# Altium project R1051-Caceres-PF.PrjPcb (part 1 of 3)
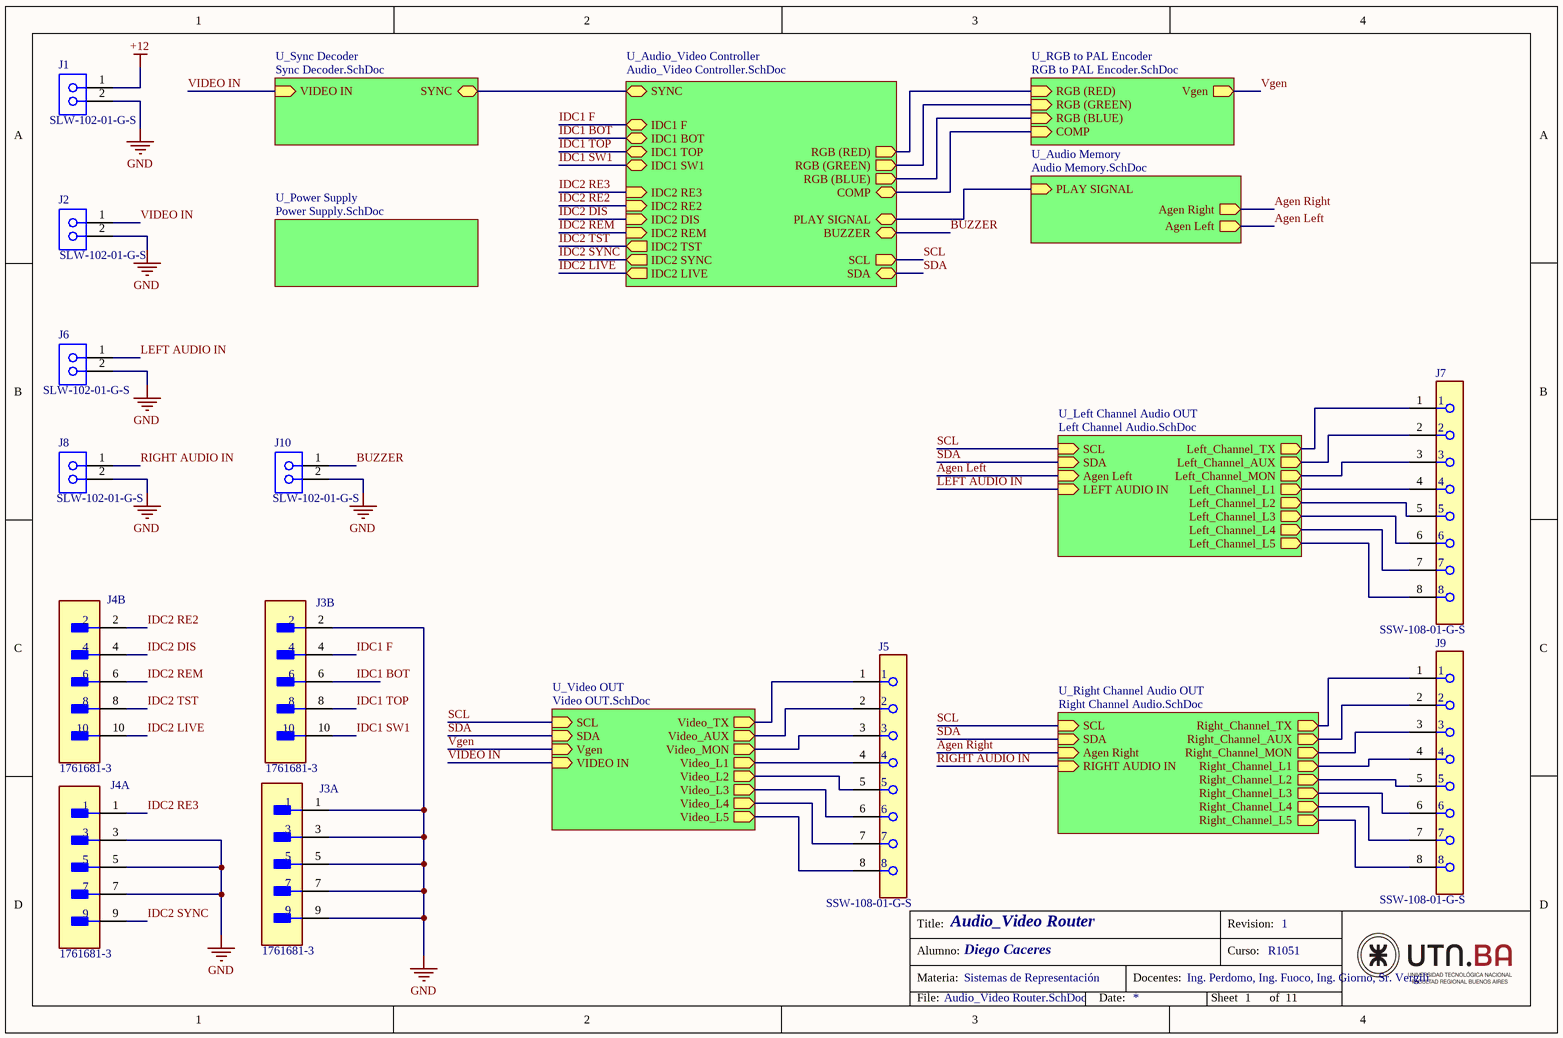
[diagram p0: Audio_Video Router.SchDoc]
11 sheets, 204 parts. Net scope: hierarchical (ports join the sheet entries above them; power ports are global).
Board file: Audio_Video Router.PcbDoc
Sheets:
  Audio_Video Router.SchDoc
    U_Sync Decoder = Sync Decoder.SchDoc
    U_Power Supply = Power Supply.SchDoc
    U_Audio_Video Controller = Audio_Video Controller.SchDoc
      U_RGB Video Controller = RGB Video Controller.SchDoc
      U_Audio Controller = Audio Controller.SchDoc
    U_Audio Memory = Audio Memory.SchDoc
    U_RGB to PAL Encoder = RGB to PAL Encoder.SchDoc
    U_Video OUT = Video OUT.SchDoc
    U_Left Channel Audio OUT = Left Channel Audio.SchDoc
    U_Right Channel Audio OUT = Right Channel Audio.SchDoc

## Sheet Audio_Video Router.SchDoc: Audio_Video Router
size A4; Organization: Altium Limited; Address1: L3, 12a Rodborough Rd; Address2: Frenchs Forest; Address3: NSW; Address4: Australia 2086; Revision: 1; SheetNumber: 1; SheetTotal: 11; Alumno: Diego Caceres; Curso: R1051; Materia: Sistemas de Representación; Docentes: Ing. Perdomo, Ing. Fuoco, Ing. Giorno, Sr. Vergili

### Parts
J1  SLW-102-01-G-S  [SMTC-SLW-102-01-X-S]
J2  SLW-102-01-G-S  [SMTC-SLW-102-01-X-S]
J3  1761681-3  [FP-1761681-3-MFG]  (parts A,B of 2)
J4  1761681-3  [FP-1761681-3-MFG]  (parts A,B of 2)
J5  SSW-108-01-G-S  [FP-SSW-108-01-G-S-MFG]
J6  SLW-102-01-G-S  [SMTC-SLW-102-01-X-S]
J7  SSW-108-01-G-S  [FP-SSW-108-01-G-S-MFG]
J8  SLW-102-01-G-S  [SMTC-SLW-102-01-X-S]
J9  SSW-108-01-G-S  [FP-SSW-108-01-G-S-MFG]
J10  SLW-102-01-G-S  [SMTC-SLW-102-01-X-S]

### Sub-sheets
U_Audio Memory = Audio Memory.SchDoc: PLAY SIGNAL (in), Agen Right (out), Agen Left (out)
U_Audio_Video Controller = Audio_Video Controller.SchDoc: RGB (RED) (out), RGB (GREEN) (out), RGB (BLUE) (out), COMP (bidir), SYNC (bidir), IDC2 SYNC (out), IDC2 LIVE (out), IDC2 TST (out), IDC2 REM (in), IDC2 DIS (in), IDC2 RE2 (in), IDC2 RE3 (in), IDC1 F (bidir), IDC1 BOT (bidir), IDC1 TOP (bidir), IDC1 SW1 (bidir), SCL (out), SDA (bidir), PLAY SIGNAL (bidir), BUZZER (bidir)
U_Left Channel Audio OUT = Left Channel Audio.SchDoc: Left_Channel_TX (out), Left_Channel_AUX (out), Left_Channel_MON (out), Left_Channel_L1 (out), SCL (in), SDA (in), Left_Channel_L2 (out), Left_Channel_L3 (out), Left_Channel_L4 (out), Left_Channel_L5 (out), Agen Left (in), LEFT AUDIO IN (in)
U_Power Supply = Power Supply.SchDoc: no entries
U_RGB to PAL Encoder = RGB to PAL Encoder.SchDoc: COMP (in), RGB (RED) (in), RGB (GREEN) (in), RGB (BLUE) (in), Vgen (out)
U_Right Channel Audio OUT = Right Channel Audio.SchDoc: Right_Channel_TX (out), Right_Channel_AUX (out), Right_Channel_MON (out), Right_Channel_L1 (out), SCL (in), SDA (in), Right_Channel_L2 (out), Right_Channel_L3 (out), Right_Channel_L4 (out), Right_Channel_L5 (out), Agen Right (in), RIGHT AUDIO IN (in)
U_Sync Decoder = Sync Decoder.SchDoc: VIDEO IN (in), SYNC (bidir)
U_Video OUT = Video OUT.SchDoc: Video_TX (out), Video_AUX (out), Video_MON (out), Video_L1 (out), SCL (in), SDA (in), Video_L2 (out), Video_L3 (out), Video_L4 (out), Video_L5 (out), Vgen (in), VIDEO IN (in)

### Nets
+12: J1.1
GND: J1.2 J2.2 J3.1 J3.2 J3.3 J3.5 J3.7 J3.9 J4.3 J4.5 J4.7 J6.2 J8.2 J10.2
Agen Left: sheet U_Audio Memory/Agen Left, sheet U_Left Channel Audio OUT/Agen Left
Agen Right: sheet U_Audio Memory/Agen Right, sheet U_Right Channel Audio OUT/Agen Right
BUZZER: J10.1 ; sheet U_Audio_Video Controller/BUZZER
COMP: sheet U_Audio_Video Controller/COMP, sheet U_RGB to PAL Encoder/COMP
IDC1 BOT: J3.6 ; sheet U_Audio_Video Controller/IDC1 BOT
IDC1 F: J3.4 ; sheet U_Audio_Video Controller/IDC1 F
IDC1 SW1: J3.10 ; sheet U_Audio_Video Controller/IDC1 SW1
IDC1 TOP: J3.8 ; sheet U_Audio_Video Controller/IDC1 TOP
IDC2 DIS: J4.4 ; sheet U_Audio_Video Controller/IDC2 DIS
IDC2 LIVE: J4.10 ; sheet U_Audio_Video Controller/IDC2 LIVE
IDC2 RE2: J4.2 ; sheet U_Audio_Video Controller/IDC2 RE2
IDC2 RE3: J4.1 ; sheet U_Audio_Video Controller/IDC2 RE3
IDC2 REM: J4.6 ; sheet U_Audio_Video Controller/IDC2 REM
IDC2 SYNC: J4.9 ; sheet U_Audio_Video Controller/IDC2 SYNC
IDC2 TST: J4.8 ; sheet U_Audio_Video Controller/IDC2 TST
LEFT AUDIO IN: J6.1 ; sheet U_Left Channel Audio OUT/LEFT AUDIO IN
PLAY SIGNAL: sheet U_Audio_Video Controller/PLAY SIGNAL, sheet U_Audio Memory/PLAY SIGNAL
RIGHT AUDIO IN: J8.1 ; sheet U_Right Channel Audio OUT/RIGHT AUDIO IN
SCL: sheet U_Audio_Video Controller/SCL, sheet U_Video OUT/SCL, sheet U_Left Channel Audio OUT/SCL, sheet U_Right Channel Audio OUT/SCL
SDA: sheet U_Audio_Video Controller/SDA, sheet U_Video OUT/SDA, sheet U_Left Channel Audio OUT/SDA, sheet U_Right Channel Audio OUT/SDA
Vgen: sheet U_RGB to PAL Encoder/Vgen, sheet U_Video OUT/Vgen
VIDEO IN: J2.1 ; sheet U_Sync Decoder/VIDEO IN, sheet U_Video OUT/VIDEO IN
NetC8_1: sheet U_Sync Decoder/SYNC, sheet U_Audio_Video Controller/SYNC
NetC22_1: sheet U_Audio_Video Controller/RGB (RED), sheet U_RGB to PAL Encoder/RGB (RED)
NetC24_1: sheet U_Audio_Video Controller/RGB (GREEN), sheet U_RGB to PAL Encoder/RGB (GREEN)
NetC25_1: sheet U_Audio_Video Controller/RGB (BLUE), sheet U_RGB to PAL Encoder/RGB (BLUE)
NetC42_1: J7.1 ; sheet U_Left Channel Audio OUT/Left_Channel_TX
NetC44_1: J7.2 ; sheet U_Left Channel Audio OUT/Left_Channel_AUX
NetC45_1: J7.3 ; sheet U_Left Channel Audio OUT/Left_Channel_MON
NetC47_1: J7.4 ; sheet U_Left Channel Audio OUT/Left_Channel_L1
NetC48_1: J7.5 ; sheet U_Left Channel Audio OUT/Left_Channel_L2
NetC50_1: J7.6 ; sheet U_Left Channel Audio OUT/Left_Channel_L3
NetC55_1: J7.7 ; sheet U_Left Channel Audio OUT/Left_Channel_L4
NetC56_1: J7.8 ; sheet U_Left Channel Audio OUT/Left_Channel_L5
NetC59_1: J9.1 ; sheet U_Right Channel Audio OUT/Right_Channel_TX
NetC61_1: J9.2 ; sheet U_Right Channel Audio OUT/Right_Channel_AUX
NetC63_1: J9.3 ; sheet U_Right Channel Audio OUT/Right_Channel_MON
NetC64_1: J9.4 ; sheet U_Right Channel Audio OUT/Right_Channel_L1
NetC66_1: J9.5 ; sheet U_Right Channel Audio OUT/Right_Channel_L2
NetC68_1: J9.6 ; sheet U_Right Channel Audio OUT/Right_Channel_L3
NetC70_1: J9.7 ; sheet U_Right Channel Audio OUT/Right_Channel_L4
NetC72_1: J9.8 ; sheet U_Right Channel Audio OUT/Right_Channel_L5
NetJ5_1: J5.1 ; sheet U_Video OUT/Video_TX
NetJ5_2: J5.2 ; sheet U_Video OUT/Video_AUX
NetJ5_3: J5.3 ; sheet U_Video OUT/Video_MON
NetJ5_4: J5.4 ; sheet U_Video OUT/Video_L1
NetJ5_5: J5.5 ; sheet U_Video OUT/Video_L2
NetJ5_6: J5.6 ; sheet U_Video OUT/Video_L3
NetJ5_7: J5.7 ; sheet U_Video OUT/Video_L4
NetJ5_8: J5.8 ; sheet U_Video OUT/Video_L5

### Notes on the sheet
- Title:
- Revision:
- Alumno:
- Materia:
- Docentes:
- Curso:
- File:
- Date:
- Sheet
- of

### Library data of the parts
J1 J2 J6 J8 J10 = CMP-1023-00125-1: Low Profile Socket Strips, Through-hole, Vertical, -55 to 125 degC, 2.54 mm Pitch, 2-Pin, Female, RoHS; Manufacturer: Samtec; Pitch: 2.54 mm; PartNumber: SLW-102-01-G-S; ComponentLink3Description: Package Specification; Mounting Technology: Through-hole; DatasheetVersion: F-214; PackageVersion: X, 9/1987; ComponentLink3URL: http://www.samtec.com/documents/webfiles/cpdf/SLW-1XX-01-X-X-MKT.pdf; Orientation: Vertical; RoHS: True; PackageReference: SLW-102-01-X-S; ComponentLink2URL: http://www.samtec.com/documents/webfiles/pdf/SLW.PDF; Temperature Range: -55 to 125 degC; ComponentLink1URL: http://www.samtec.com; ComponentLink1Description: Manufacturer URL; ComponentLink2Description: Datasheet; PackageDescription: Low Profile Socket Strip
J3 J4 = CMP-03790-46506244-1: 1761681-3 Conn Shrouded Header (4 Sides) HDR 10 POS 2.54mm Solder ST Top Entry Thru-Hole Tray; Manufacturer Lifecycle Status: ACTIVE; Number of Contacts: 10; Current Rating: 1A; Connector Type: Header, Pin, Plug; Circuit Application: Signal; Voltage Rating: 250V; Insulation Resistance: 5GΩ; Lead Length: 2.9mm; PCB Mount Retention: Without; PCB Mounting Orientation: Vertical; Connector System: Wire-to-Board; Number of Rows: 2; Row Spacing: 2.54mm; Lead Pitch: 2.54mm; Contact Mating Length: 6.096mm; Depth: 9.22mm; Shrouded End Dimension: 3.81mm; Length: 20.32mm; Mount: Through Hole; Termination: Solder, Through Hole; Orientation: Vertical; Pitch: 2.54mm; Contact Gender: Male; Contact Material: Bronze; Contact Shape: Square; Height: 8.89mm; Housing Material: Polycyclohexylenedimethylene; Contact Current Rating: 1A; Operating Supply Voltage: 250V; Lifecycle Status: Production; Color: Black; NexarPartId: 46506244; Contact Plating: Gold, Tin; Packaging: Bulk; Flammability Rating: UL94 V-0; Max Operating Temperature: 105°C; Max Voltage Rating (AC): 250V; RoHS: Compliant; Mating Connector Lock: Without; Number of Positions: 10; Housing Color: Black; REACH SVHC: No SVHC; Radiation Hardening: No; Min Operating Temperature: -65°C
J5 J7 J9 = CMP-1272-00001-2: CONN RCPT 8POS 0.1 GOLD PCB; Pitch: 2.54mm; Number of Positions: 8; Max Current Rating: 6.9A; Gender: Receptacle; Max Voltage Rating (AC): 550V; Contact Resistance: 10mR; Mating Cycles: 100; Connector Type: Socket; Series: SSW; Length: 20.83mm; Packaging: Bulk; Contact Material: Bronze; Color: Black; Housing Material: Polymer; Number of Rows: 1; REACH SVHC: No SVHC; Lead Free: Lead Free; Termination: Solder; Max Operating Temperature: 125°C; Depth: 2.41mm; Number of Contacts: 8; Min Operating Temperature: -55°C; Housing Color: Black; RoHS Compliant: Yes; Contact Plating: Gold; Radiation Hardening: No; Contact Type: Female Socket; Orientation: Vertical; Voltage Rating: 550V; Current Rating: 6.9A

## Sheet Sync Decoder.SchDoc: Sync Decoder
size A4; Organization: Altium Limited; Address1: L3, 12a Rodborough Rd; Address2: Frenchs Forest; Address3: NSW; Address4: Australia 2086; Revision: 1; SheetNumber: 3; SheetTotal: 11; Alumno: Diego Caceres; Curso: R1051; Materia: Sistemas de Representación; Docentes: Ing. Perdomo, Ing. Fuoco, Ing. Giorno, Sr. Vergili
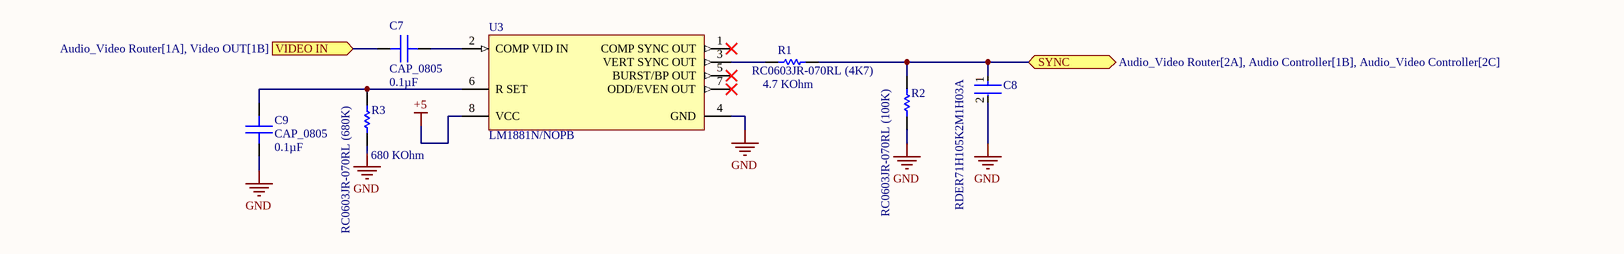
[diagram p1: Sync Decoder.SchDoc]

### Parts
C7  CAP_0805  value 0.1µF  [0805_CAPACITOR_DCACERES]
C8  RDER71H105K2M1H03A  [FP-RDE2M1-MFG]
C9  CAP_0805  value 0.1µF  [0805_CAPACITOR_DCACERES]
R1  RC0603JR-070RL (4K7)  Resistance: 4.7 KOhm  [RESC1608X55X25ML10T15]
R2  RC0603JR-070RL (100K)  [RESC1608X55X25ML10T15]
R3  RC0603JR-070RL (680K)  Resistance: 680 KOhm  [RESC1608X55X25ML10T15]
U3  LM1881N/NOPB  [P0008A]

### Ports
SYNC (bidir, see Audio_Video Router[2A], Audio Controller[1B], Audio_Video Controller[2C]), VIDEO IN (in, see Audio_Video Router[1A], Video OUT[1B])

### Nets
+5: U3.8(VCC)  [project net VDD]
GND: C8.2 C9.1 R2.1 R3.1 U3.4(GND)
VIDEO IN: C7.1 ; port VIDEO IN
NetC7_2: C7.2 U3.2(COMP_VID_IN)
NetC8_1: C8.1 R1.1 R2.2 ; port SYNC
NetC9_2: C9.2 R3.2 U3.6(R_SET)
NetR1_2: R1.2 U3.3(VERT_SYNC_OUT)

Not connected (* = marked no-connect by the designer): U3 1(COMP_SYNC_OUT)* 5(BURST/BP_OUT)* 7(ODD/EVEN_OUT)*

### Notes on the sheet
- Title:
- Revision:
- Alumno:
- Materia:
- Docentes:
- Curso:
- File:
- Date:
- Sheet
- of

### Library data of the parts
C7 C9 = CAPACITOR_0805_Caceres: Capacitor SMD, encapsulado 0805; SizePackage: 0805; ComponentLink1Description: Datasheet1; ComponentLink1URL: https://www.mouser.com/datasheet/2/40/AutoMLCCKAM-3216307.pdf; ComponentLink2Description: Datasheet2; ComponentLink2URL: https://www.mouser.com/datasheet/2/447/KEM_C1086_U2J-3316409.pdf; ComponentLink3Description: Datasheet3; ComponentLink3URL: https://product.tdk.com/system/files/dam/doc/product/capacitor/ceramic/mlcc/catalog/mlcc_commercial_soft_en.pdf
C8 = CMP-06035-045612-1: Ceramic Capacitor 1uF ±10% 50V X7R Radial; Lead Diameter: 0.5mm; Lead/Base Style: Kinked; Height - Seated (Max): 0.236inch; Tolerance: 10%; Height: 4mm; Package Quantity: 2000; Termination: Radial; Voltage Rating: 50V; Width: 4mm; Voltage Rating (DC): 50V; Lead Free: Lead Free; Case/Package: Radial; Length: 0.217inch; Mount: Through Hole; Dielectric: X7R; Packaging: Tape and Reel; Min Operating Temperature: -55°C; Max Operating Temperature: 125°C; Lead Pitch: 0.197inch; Capacitance: 1uF; Resistor Type: Ceramic
R1 R3 = CMP-2100-03667-1: Chip Resistor, 0 Ohm, +/- 5%, 0.1 W, -55 to 155 degC, 0603 (1608 Metric), RoHS, Tape and Reel; Manufacturer: Yageo; Temperature Coefficient: 200ppm/degreesC; Voltage Rating: 50V; Power Rating: 100mW; Width: 0.8mm; Max Operating Temperature: 155degC; Tolerance: 5%; Package Reference: 0603; Height: 0.45mm; Depth: 0.8mm; Package Description: 2-Pin Surface Mount Device, Body 1.6 x 0.8 mm; Termination: SMD/SMT; Package Quantity: 5000; Case/Package: 0603; Case Code (Imperial): 0603; Radiation Hardening: No; Number of Pins: 2; Length: 1.6mm; Lead Free: LeadFree; Voltage Rating (DC): 50V; Military Standard: Not; Datasheet URL: http://www.yageo.com/NewPortal/yageodocoutput?fileName=/pdf/R-Chip/PYu-RC_Group_51_RoHS_L_5.pdf; Manufacturer URL: http://www.yageo.com/; Packaging: TapeandReel; Case Code (Metric): 1608; Min Operating Temperature: -55degC; Composition: ThickFilm; RoHSCompliant: true; Contact Plating: Tin; Datasheet Version: Rev. 5, 10/2016; REACH SVHC: NoSVHC
R2 = CMP-2100-03667-1: Chip Resistor, 0 Ohm, +/- 5%, 0.1 W, -55 to 155 degC, 0603 (1608 Metric), RoHS, Tape and Reel; Manufacturer: Yageo; Temperature Coefficient: 200ppm/degreesC; Voltage Rating: 50V; Power Rating: 100mW; Resistance: 0mOhm; Width: 0.8mm; Max Operating Temperature: 155degC; Tolerance: 5%; Package Reference: 0603; Height: 0.45mm; Depth: 0.8mm; Package Description: 2-Pin Surface Mount Device, Body 1.6 x 0.8 mm; Termination: SMD/SMT; Package Quantity: 5000; Case/Package: 0603; Case Code (Imperial): 0603; Radiation Hardening: No; Number of Pins: 2; Length: 1.6mm; Lead Free: LeadFree; Voltage Rating (DC): 50V; Military Standard: Not; Datasheet URL: http://www.yageo.com/NewPortal/yageodocoutput?fileName=/pdf/R-Chip/PYu-RC_Group_51_RoHS_L_5.pdf; Manufacturer URL: http://www.yageo.com/; Packaging: TapeandReel; Case Code (Metric): 1608; Min Operating Temperature: -55degC; Composition: ThickFilm; RoHSCompliant: true; Contact Plating: Tin; Datasheet Version: Rev. 5, 10/2016; REACH SVHC: NoSVHC
U3 = CMP-0064-00008-3: Video Sync Separator, 8-pin MDIP, Pb-Free; Manufacturer: Texas Instruments; CompType: OtherParts; PowerWise: N; PackageTopMarking: NSUZXYTTE#*LM1881N; RoHS: Y; ComponentLink1Description: Datasheet URL; Code_JEDEC: MS-001-BA; PinCount: 8; PackageDescription: MDIP, .365 x .250 x .130in, 8 Lead, .100in Pitch; PackageReference: P0008A; ComponentLink1URL: http://www.ti.com/general/docs/lit/getliterature.tsp?genericPartNumber=LM1881&fileType=pdf

## Sheet Power Supply.SchDoc: Power Supply
size A4; Organization: Altium Limited; Address1: L3, 12a Rodborough Rd; Address2: Frenchs Forest; Address3: NSW; Address4: Australia 2086; Revision: 1; SheetNumber: 2; SheetTotal: 11; Alumno: Diego Caceres; Curso: R1051; Materia: Sistemas de Representación; Docentes: Ing. Perdomo, Ing. Fuoco, Ing. Giorno, Sr. Vergili
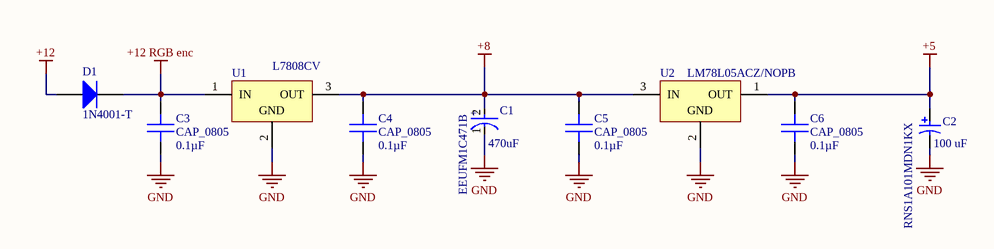
[diagram p2: Power Supply.SchDoc]

### Parts
C1  EEUFM1C471B  Capacitance: 470uF  [FP-RAD-TH-D_10_0_5-L_12_5-MFG]
C2  RNS1A101MDN1KX  Rated Capacitance: 100 uF  [NIC-RNS-8x11.5-2_V]
C3  CAP_0805  value 0.1µF  [0805_CAPACITOR_DCACERES]
C4  CAP_0805  value 0.1µF  [0805_CAPACITOR_DCACERES]
C5  CAP_0805  value 0.1µF  [0805_CAPACITOR_DCACERES]
C6  CAP_0805  value 0.1µF  [0805_CAPACITOR_DCACERES]
D1  1N4001-T  [DIOD-DO-41-P-2_V]
U1  L7808CV  [TO220]
U2  LM78L05ACZ/NOPB  [LP0003A]

### Nets
+5: C2.1 C6.1 U2.1(OUT)  [project net VDD]
+8: C1.2(A) C4.1 C5.1 U1.3(OUT) U2.3(IN)
+12: D1.1(A)
+12 RGB enc: C3.1 D1.2(K) U1.1(IN)
GND: C1.1(C) C2.2 C3.2 C4.2 C5.2 C6.2 U1.2(GND) U2.2(GND)

### Notes on the sheet
- Title:
- Revision:
- Alumno:
- Materia:
- Docentes:
- Curso:
- File:
- Date:
- Sheet
- of
- (in symbol CMP-05427-001980-1) +

### Library data of the parts
C1 = CMP-05427-001980-1: Aluminum Electrolytic Capacitors (Radial Lead Type) 470uF ±20% 16V; Ripple Current: 1.29A; ESR (Equivalent Series Resistance): 38mR; Life (Hours): 4000Hour; Lead Diameter: 0.6mm; Height: 12.5mm; Package Quantity: 500; Lead Free: Lead Free; Voltage Rating: 16V; Diameter: 10mm; Radiation Hardening: No; Packaging: Tape and Reel; Case/Package: Radial; Tolerance: 20%; Series: FM; Height - Seated (Max): 0.551inch; Max Operating Temperature: 105°C; Termination: Radial; Mount: Through Hole; RoHS Compliant: Yes; Voltage Rating (DC): 16V; Impedance: 38mR; Length: 12.5mm; Lead Pitch: 5mm; Min Operating Temperature: -40°C
C2 = CMP-1235-00001-1: Aluminum Electrolytic Capacitor, 100 uF +/-20%, 10 V, -55 to 105 degC, 2-Pin THD, RoHS; Manufacturer: Nichicon; Rated Ripple: 3900 mA; Rated Voltage: 10 V; Leakage Current: 0.15 mA; Capacitance Tolerance: +/-20%; ComponentLink1URL: http://www.nichicon.co.jp/; ComponentLink3URL: http://www.nichicon.co.jp/english/products/pdf/2013fpcap_catalog_ns.pdf; ComponentLink1Description: Manufacturer URL; ComponentLink2URL: http://www.nichicon.co.jp/english/products/pdfs/e-ns.pdf; PackageDescription: 2-Pin Through Hole Device, Dia 8 mm, Body Length 11.5 mm, Pin Spacing 3.5 mm; Temperature Range: -55 to 105 degC; ComponentLink3Description: Package Specification; PartNumber: RNS1A101MDN1KX; Mounting Technology: Through Hole; DatasheetVersion: Sep-13; RoHS: TRUE; ComponentLink2Description: Datasheet
C3-C6 = CAPACITOR_0805_Caceres: as C7 on sheet Sync Decoder; ComponentLink1Description: Datasheet1; ComponentLink1URL: https://www.mouser.com/datasheet/2/40/AutoMLCCKAM-3216307.pdf; ComponentLink2Description: Datasheet2; ComponentLink2URL: https://www.mouser.com/datasheet/2/447/KEM_C1086_U2J-3316409.pdf; ComponentLink3Description: Datasheet3; ComponentLink3URL: https://product.tdk.com/system/files/dam/doc/product/capacitor/ceramic/mlcc/catalog/mlcc_commercial_soft_en.pdf
D1 = CMP-0639-00006-2: 1.0 A Rectifier, 15 pF, 50 V, -65 to 150 degC, 2-Pin DO-41 Plastic, RoHS, Tape and Reel; Manufacturer: Diodes Inc; VF (V): 1; CT (pF): 15; Max. IR (uA): 5; VRRM (V): 50; Max. IFSM (A): 30; RoHS: TRUE; Mounting Technology: Through Hole; PartNumber: 1N4001-T; ComponentLink2Description: Datasheet; DatasheetVersion: Rev. 8-2; Operating Temperature Range (degC): -65 to 150; Packing: Tape and Reel; PackageReference: DO-41-P-2; ComponentLink1URL: http://diodes.com/; PackageDescription: 2-Pin Axial Lead, Body 4.635 x 2.36 mm, Lead Spread 25.4 mm; ComponentLink2URL: http://diodes.com/datasheets/ds28002.pdf; Max. Average Rectified Current IO (A): 1; ComponentLink1Description: Manufacturer URL
U1 = CMP-0244-00489-1: Positive Voltage Regulator, 8V, 3-Pin TO-220; ComponentLink2Description: Datasheet; ComponentLink1URL: http://www.st.com; ComponentLink2URL: http://www.st.com/internet/com/TECHNICAL_RESOURCES/TECHNICAL_LITERATURE/DATASHEET/CD00000444.pdf; PackageDescription: TO, Thru-Hole, Vertical, Heatsink Mounted; 3 In-Line Leads; Pitch 2.54 mm; ComponentLink3URL: http://www.st.com/internet/com/TECHNICAL_RESOURCES/TECHNICAL_LITERATURE/PACKAGE_INFORMATION/CD00004649.pdf; DatasheetVersion: 16/11/2011; PackageReference: TO220; ComponentLink3Description: Package Specification; PackageVersion: ver3.0; ComponentLink1Description: Manufacturer URL
U2 = CMP-0062-00040-4: 3-Terminal Positive Regulator, 5 Vout, 3-pin TO-92, Pb-Free; Manufacturer: Texas Instruments; High-Reliability: Y; PackageTopMarking: NSXYTT*LM78L*05ACZ; CompType: LDO IC; PowerWise: N; Code_JEDEC: TO-226-AA; ComponentLink1Description: Datasheet URL; PartNumber: LM78L05ACZ/NOPB; RoHS: Y; PinCount: 3; PackageDescription: TO-92, Molded, 3 Lead; ComponentLink1URL: http://www.ti.com/general/docs/lit/getliterature.tsp?genericPartNumber=LM78L05&fileType=pdf; PackageReference: LP0003A

## Sheet Audio_Video Controller.SchDoc: Audio_Video Controller
size A4; Organization: Altium Limited; Address1: L3, 12a Rodborough Rd; Address2: Frenchs Forest; Address3: NSW; Address4: Australia 2086; Revision: 1; SheetNumber: 4; SheetTotal: 11; Alumno: Diego Caceres; Curso: R1051; Materia: Sistemas de Representación; Docentes: Ing. Perdomo, Ing. Fuoco, Ing. Giorno, Sr. Vergili
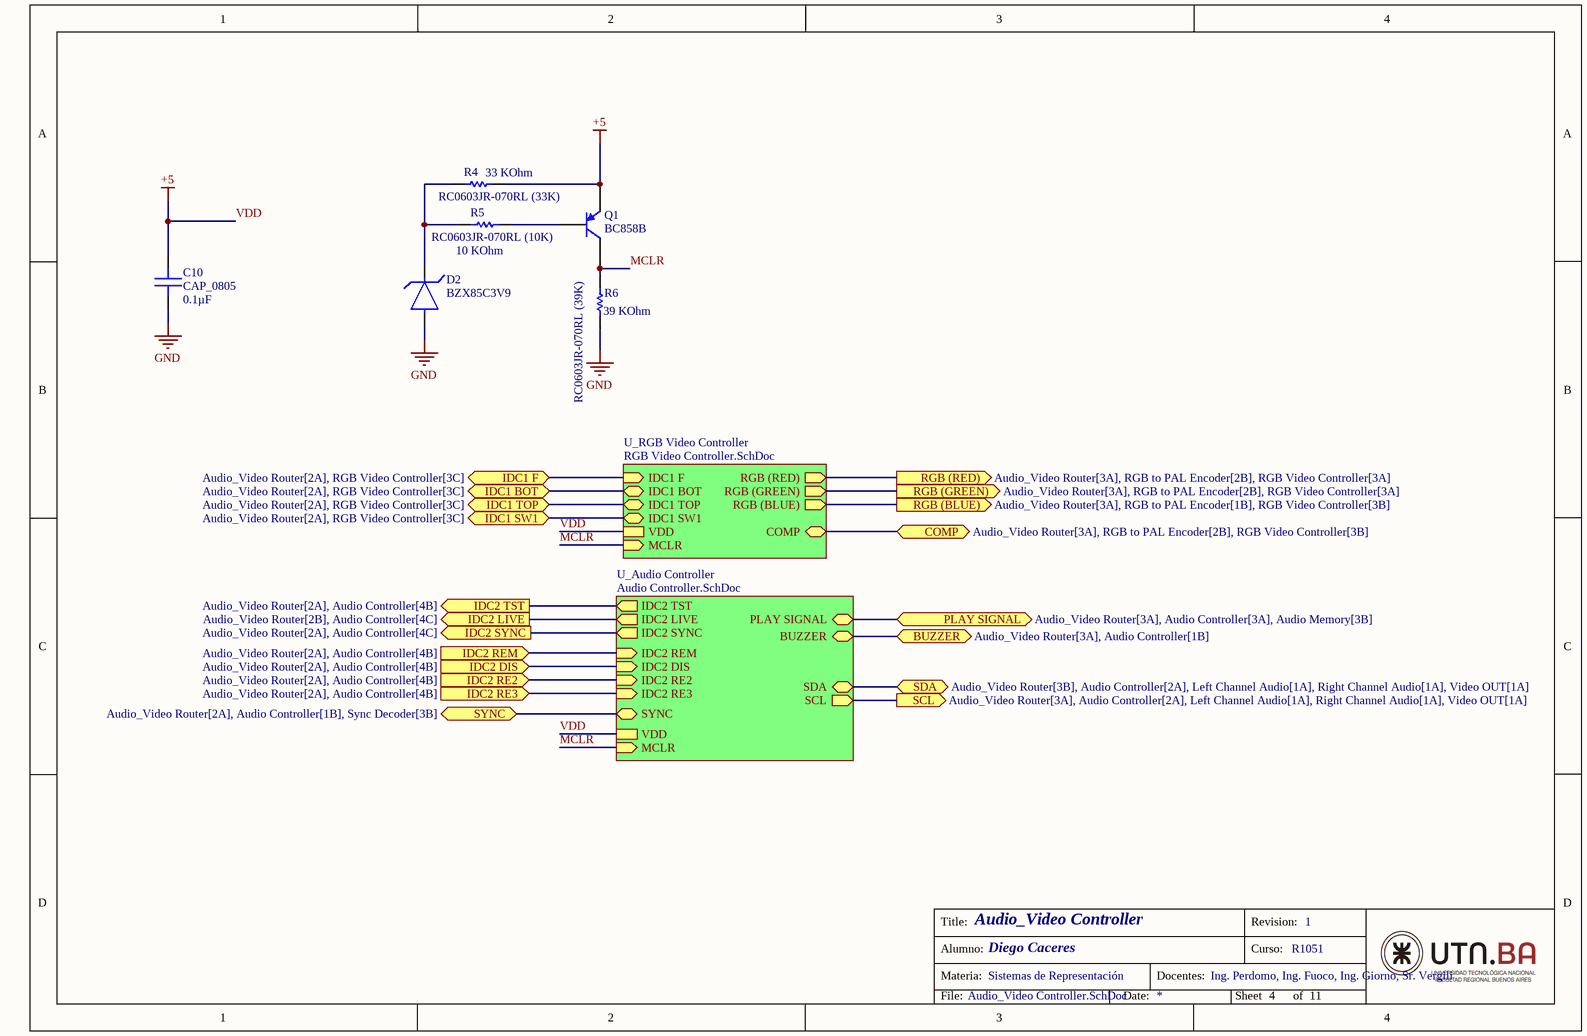
[diagram p3: Audio_Video Controller.SchDoc]

### Parts
C10  CAP_0805  value 0.1µF  [0805_CAPACITOR_DCACERES]
D2  BZX85C3V9  [AXIAL_LEAD_D0-41_BZX85C3V9_DCACERES]
Q1  BC858B  [INF-SOT23_M]
R4  RC0603JR-070RL (33K)  Resistance: 33 KOhm  [RESC1608X55X25ML10T15]
R5  RC0603JR-070RL (10K)  Resistance: 10 KOhm  [RESC1608X55X25ML10T15]
R6  RC0603JR-070RL (39K)  Resistance: 39 KOhm  [RESC1608X55X25ML10T15]

### Sub-sheets
U_Audio Controller = Audio Controller.SchDoc: IDC2 TST (out), IDC2 LIVE (out), IDC2 SYNC (out), IDC2 REM (in), IDC2 DIS (in), IDC2 RE2 (in), IDC2 RE3 (in), PLAY SIGNAL (bidir), SYNC (bidir), MCLR (in), VDD, SCL (out), SDA (bidir), BUZZER (bidir)
U_RGB Video Controller = RGB Video Controller.SchDoc: IDC1 F (in), IDC1 BOT (bidir), IDC1 TOP (bidir), IDC1 SW1 (bidir), RGB (BLUE) (out), RGB (GREEN) (out), RGB (RED) (out), VDD, COMP (bidir), MCLR (in)

### Ports
BUZZER (bidir, see Audio_Video Router[3A], Audio Controller[1B]), COMP (bidir, see Audio_Video Router[3A], RGB to PAL Encoder[2B], RGB Video Controller[3B]), IDC1 BOT (bidir, see Audio_Video Router[2A], RGB Video Controller[3C]), IDC1 F (bidir, see Audio_Video Router[2A], RGB Video Controller[3C]), IDC1 SW1 (bidir, see Audio_Video Router[2A], RGB Video Controller[3C]), IDC1 TOP (bidir, see Audio_Video Router[2A], RGB Video Controller[3C]), IDC2 DIS (in, see Audio_Video Router[2A], Audio Controller[4B]), IDC2 LIVE (out, see Audio_Video Router[2B], Audio Controller[4C]), IDC2 RE2 (in, see Audio_Video Router[2A], Audio Controller[4B]), IDC2 RE3 (in, see Audio_Video Router[2A], Audio Controller[4B]), IDC2 REM (in, see Audio_Video Router[2A], Audio Controller[4B]), IDC2 SYNC (out, see Audio_Video Router[2A], Audio Controller[4C]), IDC2 TST (out, see Audio_Video Router[2A], Audio Controller[4B]), PLAY SIGNAL (bidir, see Audio_Video Router[3A], Audio Controller[3A], Audio Memory[3B]), RGB (BLUE) (out, see Audio_Video Router[3A], RGB to PAL Encoder[1B], RGB Video Controller[3B]), RGB (GREEN) (out, see Audio_Video Router[3A], RGB to PAL Encoder[2B], RGB Video Controller[3A]), RGB (RED) (out, see Audio_Video Router[3A], RGB to PAL Encoder[2B], RGB Video Controller[3A]), SCL (out, see Audio_Video Router[3A], Audio Controller[2A], Left Channel Audio[1A], Right Channel Audio[1A], Video OUT[1A]), SDA (bidir, see Audio_Video Router[3B], Audio Controller[2A], Left Channel Audio[1A], Right Channel Audio[1A], Video OUT[1A]), SYNC (bidir, see Audio_Video Router[2A], Audio Controller[1B], Sync Decoder[3B])

### Nets
GND: C10.1 D2.1 R6.2
VDD: C10.2 Q1.2(E) R4.1 ; sheet U_RGB Video Controller/VDD, sheet U_Audio Controller/VDD  [also labelled +5]
BUZZER: port BUZZER, sheet U_Audio Controller/BUZZER
COMP: port COMP, sheet U_RGB Video Controller/COMP
IDC1 BOT: port IDC1 BOT, sheet U_RGB Video Controller/IDC1 BOT
IDC1 F: port IDC1 F, sheet U_RGB Video Controller/IDC1 F
IDC1 SW1: port IDC1 SW1, sheet U_RGB Video Controller/IDC1 SW1
IDC1 TOP: port IDC1 TOP, sheet U_RGB Video Controller/IDC1 TOP
IDC2 DIS: port IDC2 DIS, sheet U_Audio Controller/IDC2 DIS
IDC2 LIVE: port IDC2 LIVE, sheet U_Audio Controller/IDC2 LIVE
IDC2 RE2: port IDC2 RE2, sheet U_Audio Controller/IDC2 RE2
IDC2 RE3: port IDC2 RE3, sheet U_Audio Controller/IDC2 RE3
IDC2 REM: port IDC2 REM, sheet U_Audio Controller/IDC2 REM
IDC2 SYNC: port IDC2 SYNC, sheet U_Audio Controller/IDC2 SYNC
IDC2 TST: port IDC2 TST, sheet U_Audio Controller/IDC2 TST
MCLR: Q1.3(C) R6.1 ; sheet U_RGB Video Controller/MCLR, sheet U_Audio Controller/MCLR
PLAY SIGNAL: port PLAY SIGNAL, sheet U_Audio Controller/PLAY SIGNAL
SCL: port SCL, sheet U_Audio Controller/SCL
SDA: port SDA, sheet U_Audio Controller/SDA
NetC8_1: port SYNC, sheet U_Audio Controller/SYNC
NetC22_1: port RGB (RED), sheet U_RGB Video Controller/RGB (RED)
NetC24_1: port RGB (GREEN), sheet U_RGB Video Controller/RGB (GREEN)
NetC25_1: port RGB (BLUE), sheet U_RGB Video Controller/RGB (BLUE)
NetD2_2: D2.2 R4.2 R5.2
NetQ1_1: Q1.1(B) R5.1

### Notes on the sheet
- Title:
- Revision:
- Alumno:
- Materia:
- Docentes:
- Curso:
- File:
- Date:
- Sheet
- of

### Library data of the parts
C10 = CAPACITOR_0805_Caceres: as C7 on sheet Sync Decoder; ComponentLink1Description: Datasheet1; ComponentLink1URL: https://www.mouser.com/datasheet/2/40/AutoMLCCKAM-3216307.pdf; ComponentLink2Description: Datasheet2; ComponentLink2URL: https://www.mouser.com/datasheet/2/447/KEM_C1086_U2J-3316409.pdf; ComponentLink3Description: Datasheet3; ComponentLink3URL: https://product.tdk.com/system/files/dam/doc/product/capacitor/ceramic/mlcc/catalog/mlcc_commercial_soft_en.pdf
D2 = BZX85C3V9_Caceres: Diodo Zener 3.9V, BZX85C3V9, Thru Hole; PartNumber: BZX85C3V9-TR; Manufacturer: Fairchild Semiconductor; Package: DO-41; ZenerVoltage: 3.9V; ComponentLink1Description: Datasheet1; ComponentLink1URL: https://www.mouser.com/datasheet/2/308/BZX85C3V9-1300112.pdf; ComponentLink2Description: Datasheet2; ComponentLink2URL: https://www.vishay.com/docs/85607/bzx85.pdf
Q1 = CMP-1177-00040-1: PNP Silicon AF Transistor, 30 V VCEO, 100 mA IC, SOT23, Reel, Green; Manufacturer: Infineon; VCEO (max): 30Â V; Ptot (max): 330Â mW; Green: TRUE; ICBO (max): 15Â nA; fT (typ): 250Â MHz; ICM (max): 200Â mA; IC (max): 100Â mA; VEBO (max): 5Â V; PartNumber: BC858B; PackageVersion: Apr-08; VCBO (max): 30Â V; ComponentLink1Description: Manufacturer URL; PackageReference: SOT23; ComponentLink2URL: http://www.infineon.com/dgdl/bc857series_bc858series_bc859series_bc860series.pdf?folderId=db3a304314dca389011541d30fa21656&fileId=db3a304314dca389011541da0e3a1661; ComponentLink3URL: http://www.infineon.com/dgdl/SOT23-Package_Overview.pdf?folderId=db3a30431936bc4b0119532290053c66&fileId=db3a30431936bc4b0119533468123c85; ComponentLink1URL: http://www.infineon.com/; Polarity: PNP; ComponentLink2Description: Datasheet; Packing: Reel; PackageDescription: 3-Pin Small Outline Transistor Package, 1.3 x 2.9 mm Body, 0.95 mm Pitch; Mounting Technology: Surface Mount; IBM (max): 200Â mA; ComponentLink3Description: Package Specification
R4-R6 = CMP-2100-03667-1: as R1 on sheet Sync Decoder; Width: 0.8mm; Max Operating Temperature: 155degC; Tolerance: 5%; Package Reference: 0603; Height: 0.45mm; Depth: 0.8mm; Package Description: 2-Pin Surface Mount Device, Body 1.6 x 0.8 mm; Termination: SMD/SMT; Package Quantity: 5000; Case/Package: 0603; Case Code (Imperial): 0603; Radiation Hardening: No; Number of Pins: 2; Length: 1.6mm; Lead Free: LeadFree; Voltage Rating (DC): 50V; Military Standard: Not; Datasheet URL: http://www.yageo.com/NewPortal/yageodocoutput?fileName=/pdf/R-Chip/PYu-RC_Group_51_RoHS_L_5.pdf; Manufacturer URL: http://www.yageo.com/; Packaging: TapeandReel; Case Code (Metric): 1608; Min Operating Temperature: -55degC; Composition: ThickFilm; RoHSCompliant: true; Contact Plating: Tin; Datasheet Version: Rev. 5, 10/2016; REACH SVHC: NoSVHC

## Sheet RGB Video Controller.SchDoc: RGB Video Controller
size A4; Organization: Altium Limited; Address1: L3, 12a Rodborough Rd; Address2: Frenchs Forest; Address3: NSW; Address4: Australia 2086; Revision: 1; SheetNumber: 5; SheetTotal: 11; Alumno: Diego Caceres; Curso: R1051; Materia: Sistemas de Representación; Docentes: Ing. Perdomo, Ing. Fuoco, Ing. Giorno, Sr. Vergili
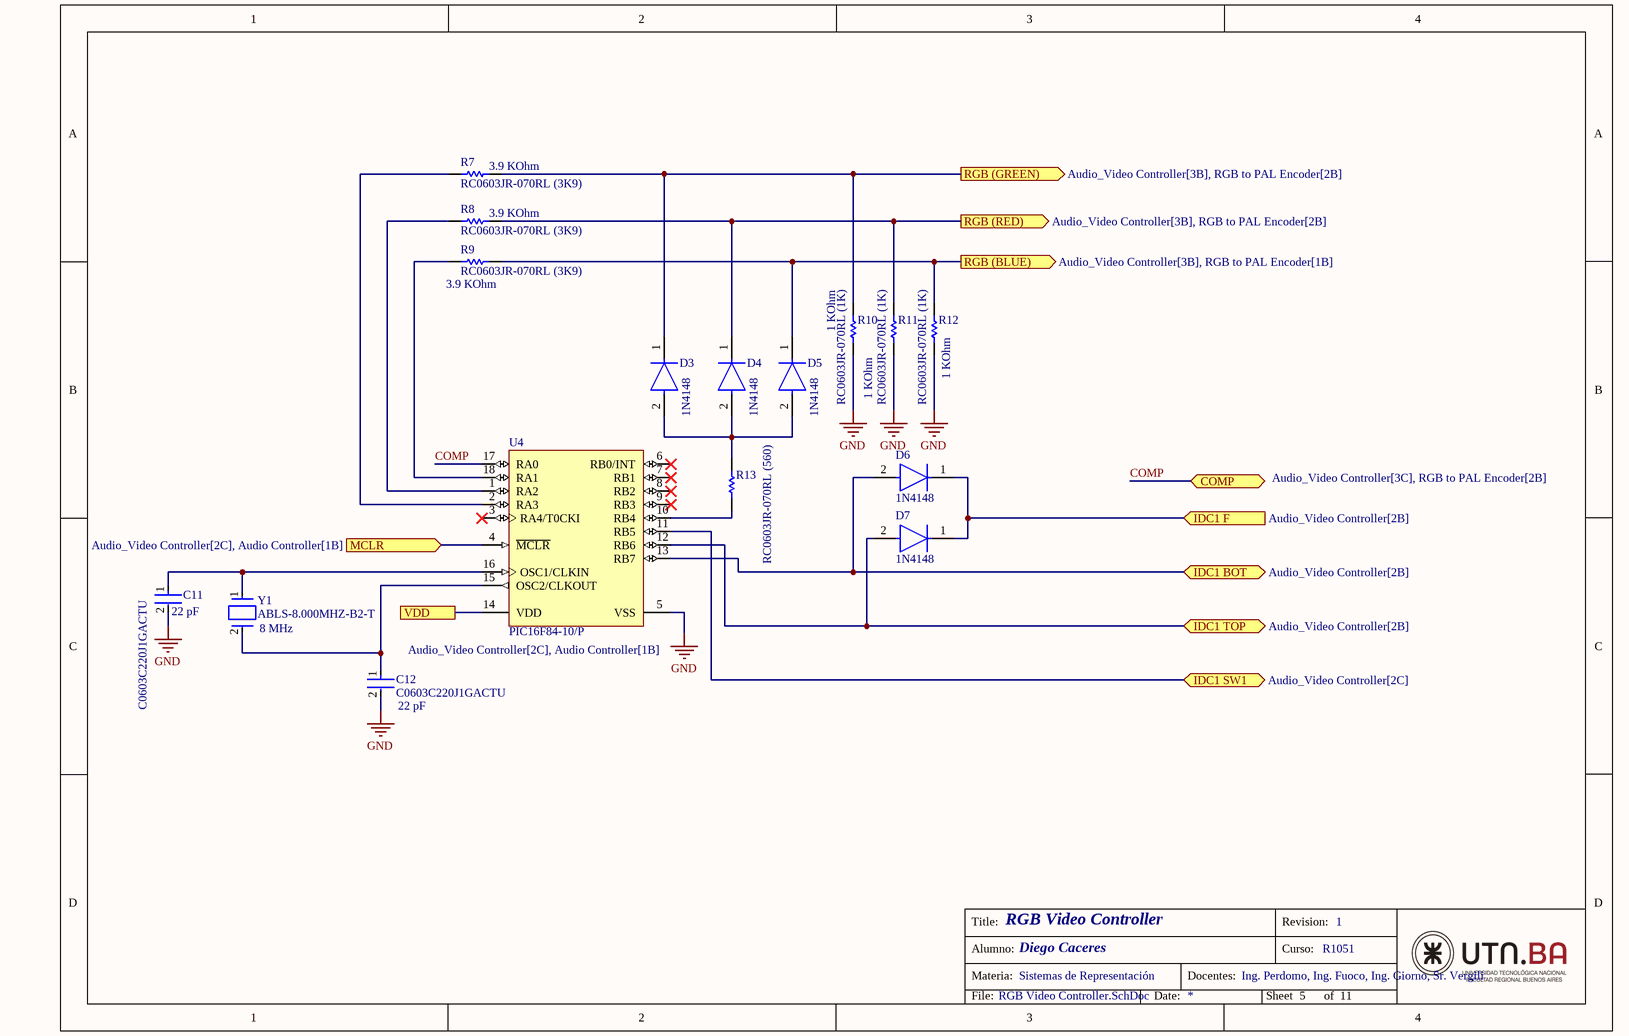
[diagram p4: RGB Video Controller.SchDoc]

### Parts
C11  C0603C220J1GACTU  value 22 pF  [FP-C0603C-CF-MFG]
C12  C0603C220J1GACTU  value 22 pF  [FP-C0603C-CF-MFG]
D3  1N4148  [FP-017AG-MFG]
D4  1N4148  [FP-017AG-MFG]
D5  1N4148  [FP-017AG-MFG]
D6  1N4148  [FP-017AG-MFG]
D7  1N4148  [FP-017AG-MFG]
R7  RC0603JR-070RL (3K9)  Resistance: 3.9 KOhm  [RESC1608X55X25ML10T15]
R8  RC0603JR-070RL (3K9)  Resistance: 3.9 KOhm  [RESC1608X55X25ML10T15]
R9  RC0603JR-070RL (3K9)  Resistance: 3.9 KOhm  [RESC1608X55X25ML10T15]
R10  RC0603JR-070RL (1K)  Resistance: 1 KOhm  [RESC1608X55X25ML10T15]
R11  RC0603JR-070RL (1K)  Resistance: 1 KOhm  [RESC1608X55X25ML10T15]
R12  RC0603JR-070RL (1K)  Resistance: 1 KOhm  [RESC1608X55X25ML10T15]
R13  RC0603JR-070RL (560)  [RESC1608X55X25ML10T15]
U4  PIC16F84-10/P  [MCHP-PDIP-P18]
Y1  ABLS-8.000MHZ-B2-T  Operating Frequency: 8 MHz  [FP-ABLS-MFG]

### Ports
COMP (bidir, see Audio_Video Controller[3C], RGB to PAL Encoder[2B]), IDC1 BOT (bidir, see Audio_Video Controller[2B]), IDC1 F (in, see Audio_Video Controller[2B]), IDC1 SW1 (bidir, see Audio_Video Controller[2C]), IDC1 TOP (bidir, see Audio_Video Controller[2B]), MCLR (in, see Audio_Video Controller[2C], Audio Controller[1B]), RGB (BLUE) (out, see Audio_Video Controller[3B], RGB to PAL Encoder[1B]), RGB (GREEN) (out, see Audio_Video Controller[3B], RGB to PAL Encoder[2B]), RGB (RED) (out, see Audio_Video Controller[3B], RGB to PAL Encoder[2B]), VDD (see Audio_Video Controller[2C], Audio Controller[1B])

### Nets
GND: C11.2 C12.2 R10.2 R11.2 R12.2 U4.5(VSS)
VDD: U4.14(VDD) ; port VDD
COMP: U4.17(RA0) ; port COMP
IDC1 BOT: D6.2(A) U4.13(RB7) ; port IDC1 BOT
IDC1 F: D6.1(C) D7.1(C) ; port IDC1 F
IDC1 SW1: U4.11(RB5) ; port IDC1 SW1
IDC1 TOP: D7.2(A) U4.12(RB6) ; port IDC1 TOP
MCLR: U4.4(~{MCLR}) ; port MCLR
NetC11_1: C11.1 U4.16(OSC1/CLKIN) Y1.1
NetC12_1: C12.1 U4.15(OSC2/CLKOUT) Y1.2
NetC22_1: D4.1(C) R8.1 R11.1 ; port RGB (RED)
NetC24_1: D3.1(C) R7.1 R10.1 ; port RGB (GREEN)
NetC25_1: D5.1(C) R9.1 R12.1 ; port RGB (BLUE)
NetD3_2: D3.2(A) D4.2(A) D5.2(A) R13.1
NetR7_2: R7.2 U4.2(RA3)
NetR8_2: R8.2 U4.1(RA2)
NetR9_2: R9.2 U4.18(RA1)
NetR13_2: R13.2 U4.10(RB4)

Not connected (* = marked no-connect by the designer): U4 3(RA4/T0CKI)* 6(RB0/INT)* 7(RB1)* 8(RB2)* 9(RB3)*

### Notes on the sheet
- Title:
- Revision:
- Alumno:
- Materia:
- Docentes:
- Curso:
- File:
- Date:
- Sheet
- of

### Library data of the parts
C11 C12 = CMP-2006-03322-2: CAP CER 22PF 100V 5% NP0 0603; Manufacturer: KEMET; Material: Ceramic; Automotive Grade: Grade 1; Temperature Characteristic: C0G; Temperature Coefficient: 30ppm/°C; Tolerance: 0.05; Temperature Range High: +125°C; Capacitance: 22 pF; ComponentLink2URL: https://api.kemet.com/component-edge/download/datasheet/C0603C100J5GACAUTO.pdf; Package: C0603C-CF; Category: Cap; Voltage Rating: 100 V; Automotive: Yes; Mouser Description: Multilayer Ceramic Capacitors MLCC - SMD/SMT 100volts 22pF C0G 5%; Device Class L1: Passive Components; Device Class L3: Ceramic Capacitors; Temperature: -55°C to +125°C; Digikey Description: CAP CER 22PF 100V 5% NP0 0603; RoHS: TRUE; ComponentLink2Description: Datasheet; Height: 0.87mm; Temperature Range Low: -55°C; Manufacturer Part Number: C0603C220J1GACTU; Device Class L2: Capacitors; Octopart: https://octopart.com/c0603c220j1gactu-kemet-9142653; Lead Free: Yes
D3-D7 = CMP-07163-000046-1: DIODE GEN PURP 100V 200MA DO35; Forward Voltage: 1V; Max Power Dissipation: 500mW; Max Reverse Current: 5uA; Forward Current: 300mA; Current: 4A; Reverse Recovery Time: 4ns; Element Configuration: Single; Outside Diameter: 1.85mm; Capacitance: 4pF; Polarity: Standard; Max Forward Surge Current (Ifsm): 1A; Reverse Voltage: 100V; Output Current: 200mA; Average Rectified Current: 200mA; Diameter: 1.91mm; Max Repetitive Reverse Voltage (Vrrm): 100V; Current Rating: 200mA; Case/Package: DO-35; Lead Free: Lead Free; Number of Pins: 2; Recovery Time: 4ns; Packaging: Bulk; Contact Plating: Tin; Voltage: 100V; Mount: Through Hole; Max Surge Current: 4A; Package Quantity: 2000; Width: 1.91mm; Max Reverse Voltage (DC): 100V; Length: 4.56mm; Radiation Hardening: No; Power Dissipation: 500mW; Voltage Rating (DC): 100V; Peak Non-Repetitive Surge Current: 4A; REACH SVHC: No SVHC; Height: 4.56mm; Max Operating Temperature: 175°C; Series: -; Weight: 0.01lb; Min Operating Temperature: -65°C
R7-R12 = CMP-2100-03667-1: as R1 on sheet Sync Decoder; Width: 0.8mm; Max Operating Temperature: 155degC; Tolerance: 5%; Package Reference: 0603; Height: 0.45mm; Depth: 0.8mm; Package Description: 2-Pin Surface Mount Device, Body 1.6 x 0.8 mm; Termination: SMD/SMT; Package Quantity: 5000; Case/Package: 0603; Case Code (Imperial): 0603; Radiation Hardening: No; Number of Pins: 2; Length: 1.6mm; Lead Free: LeadFree; Voltage Rating (DC): 50V; Military Standard: Not; Datasheet URL: http://www.yageo.com/NewPortal/yageodocoutput?fileName=/pdf/R-Chip/PYu-RC_Group_51_RoHS_L_5.pdf; Manufacturer URL: http://www.yageo.com/; Packaging: TapeandReel; Case Code (Metric): 1608; Min Operating Temperature: -55degC; Composition: ThickFilm; RoHSCompliant: true; Contact Plating: Tin; Datasheet Version: Rev. 5, 10/2016; REACH SVHC: NoSVHC
R13 = CMP-2100-03667-1: as R2 on sheet Sync Decoder; Width: 0.8mm; Max Operating Temperature: 155degC; Tolerance: 5%; Package Reference: 0603; Height: 0.45mm; Depth: 0.8mm; Package Description: 2-Pin Surface Mount Device, Body 1.6 x 0.8 mm; Termination: SMD/SMT; Package Quantity: 5000; Case/Package: 0603; Case Code (Imperial): 0603; Radiation Hardening: No; Number of Pins: 2; Length: 1.6mm; Lead Free: LeadFree; Voltage Rating (DC): 50V; Military Standard: Not; Datasheet URL: http://www.yageo.com/NewPortal/yageodocoutput?fileName=/pdf/R-Chip/PYu-RC_Group_51_RoHS_L_5.pdf; Manufacturer URL: http://www.yageo.com/; Packaging: TapeandReel; Case Code (Metric): 1608; Min Operating Temperature: -55degC; Composition: ThickFilm; RoHSCompliant: true; Contact Plating: Tin; Datasheet Version: Rev. 5, 10/2016; REACH SVHC: NoSVHC
U4 = CMP-0115-01673-1: Flash / EEPROM 8-Bit Microcontroller, 10 MHz, 13 I/O, 0 to 70 degC, 18-pin PDIP (P18), Tube; Manufacturer: Microchip; Digital Communication: 0 -UART, 0 -A/E/USART, 0 -SPI, 0 -I2C, 0 -MSSP(SPI/I2C), 0 -SSP(SPI/I2C); I/O Pins: 13; Program Memory KWords: 1; Max. CPU Speed MHz: 10; Timers: 1 - 8-bit, 0 - 16-bit; EEPROM Data Memory (bytes): 64; Operation Voltage Range: 2V - 6V; RAM: 68; Program Memory KBytes: 1.75; ComponentLink2Description: Package Specification; PackageReference: PDIP-P18; ComponentLink3Description: URL Link1; ComponentLink1Description: Datasheet; ComponentLink3URL: Product URL:http://www.microchip.com/datasheet/PIC16F84; RoHS: TRUE; PackageDescription: 18-Lead Plastic Dual In-Line, Row Spacing 7.62 mm, 22.86 x 6.6 mm Body, 2.54 mm Pitch; DatasheetVersion: Rev. D; Mounting Technology: Through Hole; PackageVersion: C04-007B, 12/2012; Packing: TUBE; ComponentLink1URL: http://ww1.microchip.com/downloads/en/DeviceDoc/30430D.pdf; Memory Type: Flash; PartNumber: PIC16F84-10/P; ComponentLink2URL: http://www.microchip.com/stellent/groups/techpub_sg/documents/packagingspec/en012702.pdf
Y1 = CMP-27762-009874-1: CRYSTAL 8.0000MHZ 18PF SMD; ESR (Equivalent Series Resistance): 80R; Frequency Stability: 50ppm; Tolerance: 20ppm; Frequency: 8MHz; Min Operating Temperature: -20°C; Lead Free: Lead Free; Width: 4.7mm; Packaging: Tape and Reel; Series: ABLS; Accuracy: 20ppm; Length: 11.4mm; Frequency Tolerance: 20ppm; Termination: SMD/SMT; Number of Pins: 2; Radiation Hardening: No; Depth: 4.7mm; REACH SVHC: No SVHC; Contact Plating: Tin; Load Capacitance: 18pF; Case/Package: SMD/SMT; Mount: Surface Mount; Package Quantity: 1000; Max Operating Temperature: 70°C; Height: 0.165inch; Series Resistance: 80R

## Sheet Audio Controller.SchDoc: Audio Controller
size A4; Organization: Altium Limited; Address1: L3, 12a Rodborough Rd; Address2: Frenchs Forest; Address3: NSW; Address4: Australia 2086; Revision: 1; SheetNumber: 6; SheetTotal: 11; Alumno: Diego Caceres; Curso: R1051; Materia: Sistemas de Representación; Docentes: Ing. Perdomo, Ing. Fuoco, Ing. Giorno, Sr. Vergili
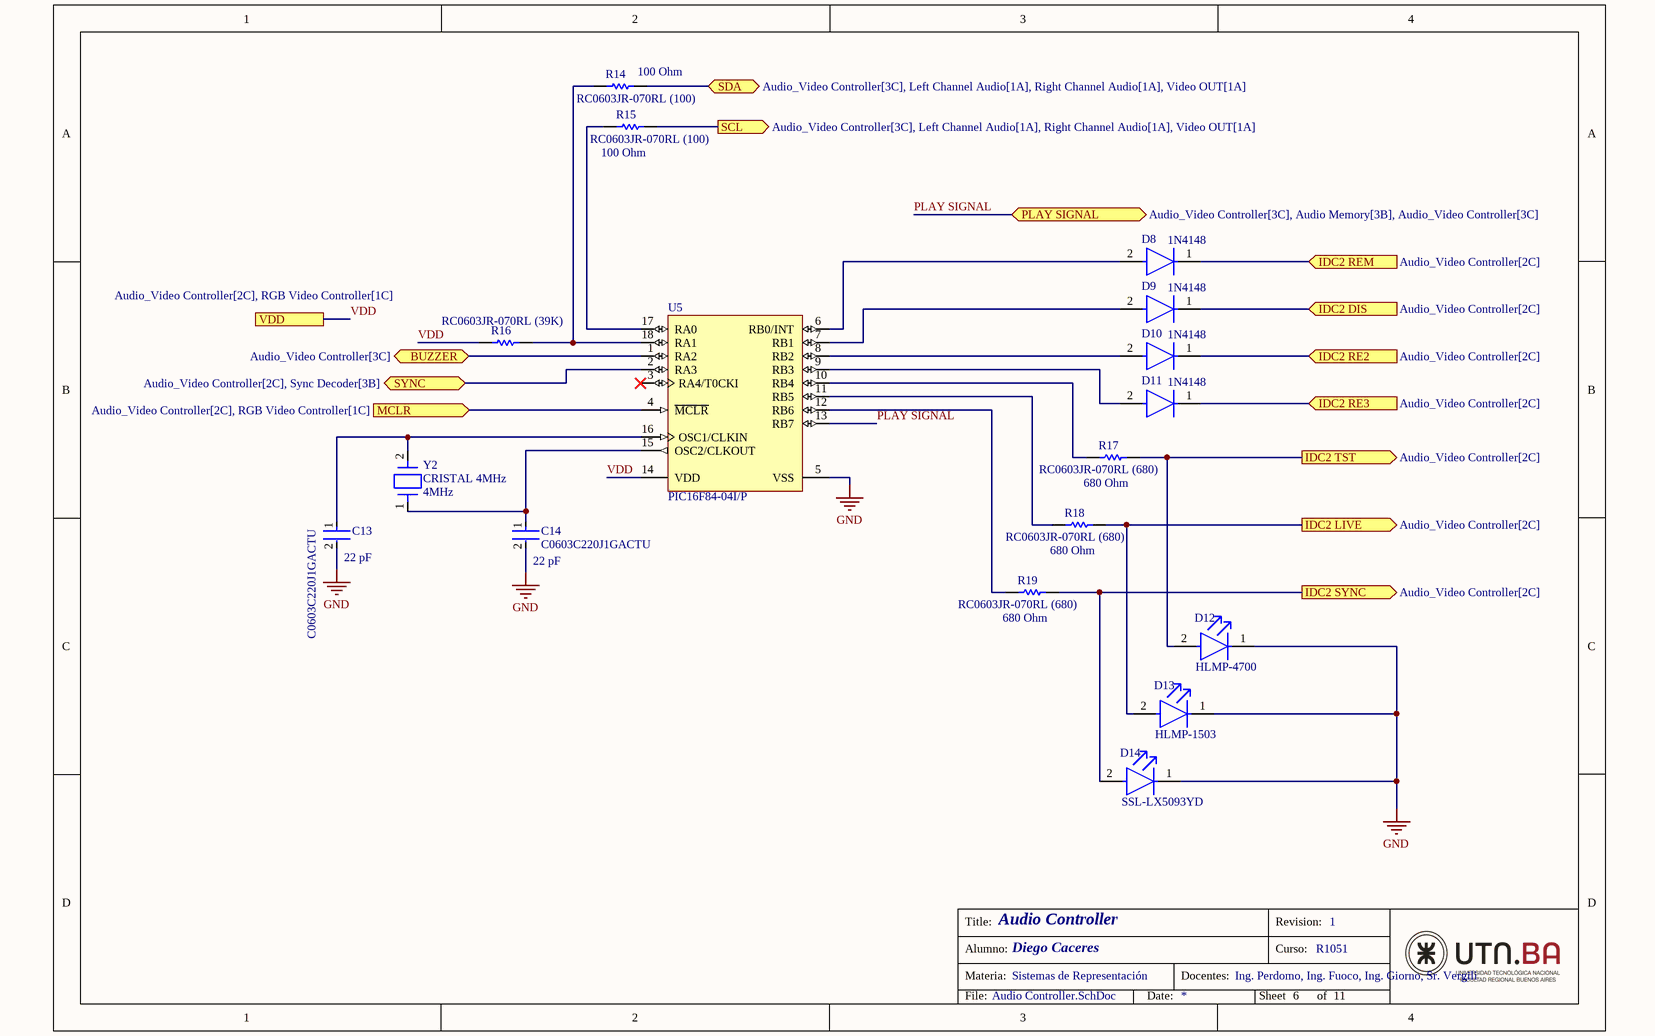
[diagram p5: Audio Controller.SchDoc]

### Parts
C13  C0603C220J1GACTU  Capacitance: 22 pF  [FP-C0603C-CF-MFG]
C14  C0603C220J1GACTU  value 22 pF  [FP-C0603C-CF-MFG]
D8  1N4148  [FP-017AG-MFG]
D9  1N4148  [FP-017AG-MFG]
D10  1N4148  [FP-017AG-MFG]
D11  1N4148  [FP-017AG-MFG]
D12  HLMP-4700  [FP-HLMP-4700-MFG]
D13  HLMP-1503  [FP-HLMP-1503-MFG]
D14  SSL-LX5093YD  [FP-SSL-LX5093YD-MFG]
R14  RC0603JR-070RL (100)  Resistance: 100 Ohm  [RESC1608X55X25ML10T15]
R15  RC0603JR-070RL (100)  Resistance: 100 Ohm  [RESC1608X55X25ML10T15]
R16  RC0603JR-070RL (39K)  [RESC1608X55X25ML10T15]
R17  RC0603JR-070RL (680)  Resistance: 680 Ohm  [RESC1608X55X25ML10T15]
R18  RC0603JR-070RL (680)  Resistance: 680 Ohm  [RESC1608X55X25ML10T15]
R19  RC0603JR-070RL (680)  Resistance: 680 Ohm  [RESC1608X55X25ML10T15]
U5  PIC16F84-04I/P  [MCHP-PDIP-P18]
Y2  CRISTAL 4MHz  Frequency: 4MHz  [HC-49/US_SMD_CRISTAL 4MHz_DCACERES]

### Ports
BUZZER (bidir, see Audio_Video Controller[3C]), IDC2 DIS (in, see Audio_Video Controller[2C]), IDC2 LIVE (out, see Audio_Video Controller[2C]), IDC2 RE2 (in, see Audio_Video Controller[2C]), IDC2 RE3 (in, see Audio_Video Controller[2C]), IDC2 REM (in, see Audio_Video Controller[2C]), IDC2 SYNC (out, see Audio_Video Controller[2C]), IDC2 TST (out, see Audio_Video Controller[2C]), MCLR (in, see Audio_Video Controller[2C], RGB Video Controller[1C]), PLAY SIGNAL (bidir, see Audio_Video Controller[3C], Audio Memory[3B], Audio_Video Controller[3C]), SCL (out, see Audio_Video Controller[3C], Left Channel Audio[1A], Right Channel Audio[1A], Video OUT[1A]), SDA (bidir, see Audio_Video Controller[3C], Left Channel Audio[1A], Right Channel Audio[1A], Video OUT[1A]), SYNC (bidir, see Audio_Video Controller[2C], Sync Decoder[3B]), VDD (see Audio_Video Controller[2C], RGB Video Controller[1C])

### Nets
GND: C13.2 C14.2 D12.1(C) D13.1(C) D14.1(C) U5.5(VSS)
VDD: R16.2 U5.14(VDD) ; port VDD
BUZZER: U5.1(RA2) ; port BUZZER
IDC2 DIS: D9.1(C) ; port IDC2 DIS
IDC2 LIVE: D13.2(A) R18.1 ; port IDC2 LIVE
IDC2 RE2: D10.1(C) ; port IDC2 RE2
IDC2 RE3: D11.1(C) ; port IDC2 RE3
IDC2 REM: D8.1(C) ; port IDC2 REM
IDC2 SYNC: D14.2(A) R19.1 ; port IDC2 SYNC
IDC2 TST: D12.2(A) R17.1 ; port IDC2 TST
MCLR: U5.4(~{MCLR}) ; port MCLR
PLAY SIGNAL: U5.13(RB7) ; port PLAY SIGNAL
SCL: R15.1 ; port SCL
SDA: R14.1 ; port SDA
NetC8_1: U5.2(RA3) ; port SYNC
NetC13_1: C13.1 U5.16(OSC1/CLKIN) Y2.2
NetC14_1: C14.1 U5.15(OSC2/CLKOUT) Y2.1
NetD8_2: D8.2(A) U5.6(RB0/INT)
NetD9_2: D9.2(A) U5.7(RB1)
NetD10_2: D10.2(A) U5.8(RB2)
NetD11_2: D11.2(A) U5.9(RB3)
NetR14_2: R14.2 R16.1 U5.18(RA1)
NetR15_2: R15.2 U5.17(RA0)
NetR17_2: R17.2 U5.10(RB4)
NetR18_2: R18.2 U5.11(RB5)
NetR19_2: R19.2 U5.12(RB6)

Not connected (* = marked no-connect by the designer): U5 3(RA4/T0CKI)*

### Notes on the sheet
- Title:
- Revision:
- Alumno:
- Materia:
- Docentes:
- Curso:
- File:
- Date:
- Sheet
- of

### Library data of the parts
C13 C14 = CMP-2006-03322-2: as C11 on sheet RGB Video Controller; Temperature Range High: +125°C; ComponentLink2URL: https://api.kemet.com/component-edge/download/datasheet/C0603C100J5GACAUTO.pdf; Package: C0603C-CF; Category: Cap; Voltage Rating: 100 V; Automotive: Yes; Mouser Description: Multilayer Ceramic Capacitors MLCC - SMD/SMT 100volts 22pF C0G 5%; Device Class L1: Passive Components; Device Class L3: Ceramic Capacitors; Temperature: -55°C to +125°C; Digikey Description: CAP CER 22PF 100V 5% NP0 0603; RoHS: TRUE; ComponentLink2Description: Datasheet; Height: 0.87mm; Temperature Range Low: -55°C; Manufacturer Part Number: C0603C220J1GACTU; Device Class L2: Capacitors; Octopart: https://octopart.com/c0603c220j1gactu-kemet-9142653; Lead Free: Yes
  C13: Value: 22 pF
  C14: Capacitance: 22 pF
D8-D11 = CMP-07163-000046-1: as D3 on sheet RGB Video Controller; Reverse Voltage: 100V; Output Current: 200mA; Average Rectified Current: 200mA; Diameter: 1.91mm; Max Repetitive Reverse Voltage (Vrrm): 100V; Current Rating: 200mA; Case/Package: DO-35; Lead Free: Lead Free; Number of Pins: 2; Recovery Time: 4ns; Packaging: Bulk; Contact Plating: Tin; Voltage: 100V; Mount: Through Hole; Max Surge Current: 4A; Package Quantity: 2000; Width: 1.91mm; Max Reverse Voltage (DC): 100V; Length: 4.56mm; Radiation Hardening: No; Power Dissipation: 500mW; Voltage Rating (DC): 100V; Peak Non-Repetitive Surge Current: 4A; REACH SVHC: No SVHC; Height: 4.56mm; Max Operating Temperature: 175°C; Series: -; Weight: 0.01lb; Min Operating Temperature: -65°C
D12 = CMP-18399-000008-1: LED RED DIFFUSED T-1 3/4 T/H; Manufacturer: Broadcom; Luminous Intensity: 2.3mcd; Peak Emmision Wavelength: 635nm; Forward Voltage: 1.7V; Viewing Angle: 50°; Led Orientation: Straight; Reverse Voltage: 5V; Forward Current: 2mA; Power Dissipation: 14mW; Wavelength: 626nm; Digikey Description: LED RED DIFFUSED T-1 3/4 T/H; Device Class L3: unset; Temperature Range Low: -40°C; Temperature Range High: +100°C; RoHS: TRUE; Package: HLMP-4700; Octopart: https://octopart.com/hlmp-4700-broadcom-71130526; Automotive: No; ComponentLink2URL: https://docs.broadcom.com/docs/AV02-1557EN; Colour: Red; Temperature: -40°C to +100°C; Lead Free: Yes; Category: Diode; ComponentLink2Description: Datasheet; Manufacturer Part Number: HLMP-4700; Device Class L1: Optoelectronics; Device Class L2: LEDs; Mouser Description: LED; Red; 2.3mcd; 0.24In.Dia.; T-1-3/4; 500mA; 1.7V; 635nm; 50deg; 5V; 24mW; -55degC;
D13 = CMP-18399-000010-1: LED GREEN DIFFUSED T-1 T/H; Manufacturer: Broadcom; Reverse Voltage: 5V; Wavelength: 569nm; Forward Voltage: 2.1V; Led Orientation: Straight; Viewing Angle: 60°; Max Junction Temp: +110°C; Peak Emmision Wavelength: 565nm; Luminous Intensity: 1mcd; Standoff Height: 0.88mm; Forward Current: 10mA; Mouser Description: LED; Green; 1mcd; 0.115In.Dia.; T-1; 565nm; 25mA; 2.1V; 5V; GaP; -20degC; 100deg; ComponentLink2Description: Datasheet; Digikey Description: LED GREEN DIFFUSED T-1 T/H; Device Class L1: Optoelectronics; Device Class L3: unset; Automotive: No; Device Class L2: LEDs; Manufacturer Part Number: HLMP-1503; Category: Diode; Temperature Range Low: -20°C; Height: 6.35mm; RoHS: TRUE; Octopart: https://octopart.com/hlmp-1503-broadcom-71130371; Temperature: -20°C to +100°C; Lead Free: Yes; ComponentLink2URL: https://docs.broadcom.com/docs/AV02-1555EN; Package: HLMP-1503; Colour: Green; Temperature Range High: +100°C
D14 = CMP-57192-000007-1: LED YELLOW DIFFUSED T-1 3/4 T/H; Test Current: 20mA; Number of LEDs: 1; Dominant Wavelength: 568nm; Wavelength: 585nm; Forward Voltage: 2.1V; Lens Style: Dome; Viewing Angle: 60°; Luminous Intensity: 30mcd; Min Operating Temperature: -40°C; Packaging: Bulk; Width: 1.5inch; Lead Free: Lead Free; Number of Pins: 2; Color: Yellow; Case/Package: Radial; Forward Current: 20mA; REACH SVHC: No SVHC; Lens Transparency: Diffused; Weight: 0.01lb; Height: 8.6mm; Package Quantity: 1000; Series: -; Length: 0.5inch; Illumination Color: Yellow; Mount: Through Hole; Diameter: 5mm; RoHS Compliant: Yes; Lens Color: Yellow; Max Operating Temperature: 85°C
R14 R15 R17-R19 = CMP-2100-03667-1: as R1 on sheet Sync Decoder; Width: 0.8mm; Max Operating Temperature: 155degC; Tolerance: 5%; Package Reference: 0603; Height: 0.45mm; Depth: 0.8mm; Package Description: 2-Pin Surface Mount Device, Body 1.6 x 0.8 mm; Termination: SMD/SMT; Package Quantity: 5000; Case/Package: 0603; Case Code (Imperial): 0603; Radiation Hardening: No; Number of Pins: 2; Length: 1.6mm; Lead Free: LeadFree; Voltage Rating (DC): 50V; Military Standard: Not; Datasheet URL: http://www.yageo.com/NewPortal/yageodocoutput?fileName=/pdf/R-Chip/PYu-RC_Group_51_RoHS_L_5.pdf; Manufacturer URL: http://www.yageo.com/; Packaging: TapeandReel; Case Code (Metric): 1608; Min Operating Temperature: -55degC; Composition: ThickFilm; RoHSCompliant: true; Contact Plating: Tin; Datasheet Version: Rev. 5, 10/2016; REACH SVHC: NoSVHC
R16 = CMP-2100-03667-1: as R2 on sheet Sync Decoder; Width: 0.8mm; Max Operating Temperature: 155degC; Tolerance: 5%; Package Reference: 0603; Height: 0.45mm; Depth: 0.8mm; Package Description: 2-Pin Surface Mount Device, Body 1.6 x 0.8 mm; Termination: SMD/SMT; Package Quantity: 5000; Case/Package: 0603; Case Code (Imperial): 0603; Radiation Hardening: No; Number of Pins: 2; Length: 1.6mm; Lead Free: LeadFree; Voltage Rating (DC): 50V; Military Standard: Not; Datasheet URL: http://www.yageo.com/NewPortal/yageodocoutput?fileName=/pdf/R-Chip/PYu-RC_Group_51_RoHS_L_5.pdf; Manufacturer URL: http://www.yageo.com/; Packaging: TapeandReel; Case Code (Metric): 1608; Min Operating Temperature: -55degC; Composition: ThickFilm; RoHSCompliant: true; Contact Plating: Tin; Datasheet Version: Rev. 5, 10/2016; REACH SVHC: NoSVHC
U5 = CMP-0115-01671-1: Flash / EEPROM 8-Bit Microcontroller, 4 MHz, 13 I/O, -40 to 85 degC, 18-pin PDIP (P18), Tube; Manufacturer: Microchip; I/O Pins: 13; Digital Communication: 0 -UART, 0 -A/E/USART, 0 -SPI, 0 -I2C, 0 -MSSP(SPI/I2C), 0 -SSP(SPI/I2C); Operation Voltage Range: 4V - 6V; RAM: 68; EEPROM Data Memory (bytes): 64; Program Memory KBytes: 1.75; Program Memory KWords: 1; Timers: 1 - 8-bit; Max. CPU Speed MHz: 4; ComponentLink2URL: http://www.microchip.com/stellent/groups/techpub_sg/documents/packagingspec/en012702.pdf; ComponentLink1Description: Datasheet; ComponentLink3URL: Product URL:http://www.microchip.com/datasheet/PIC16F84; ComponentLink3Description: URL Link1; ComponentLink2Description: Package Specification; ComponentLink1URL: http://ww1.microchip.com/downloads/en/DeviceDoc/30430D.pdf; Packing: TUBE; PackageDescription: 18-Lead Plastic Dual In-Line, Row Spacing 7.62 mm, 22.86 x 6.6 mm Body, 2.54 mm Pitch; Mounting Technology: Through Hole; Memory Type: Flash; RoHS: TRUE; PackageVersion: C04-007B, 12/2012; PartNumber: PIC16F84-04I/P; PackageReference: PDIP-P18; DatasheetVersion: Rev. D
Y2 = Cristal_4MHz_Caceres: Cristal SMD 4.00MHz; PartNumber: ABLS-4.000MHZ-K4T; Manufacturer: Abracon; ComponentLink1Description: Datasheet; ComponentLink1URL: https://www.mouser.com/datasheet/2/3/abls-1664338.pdf; Package: HC-49/US; TerminalForm: SMD; Series: ABLS; ComponentLink2Description: URL Link1; ComponentLink2URL: https://www.mouser.com/ProductDetail/ABRACON/ABLS-4.000MHZ-K4T?qs=uDmhV2jwPRfEVDsdVpSQ5A%3D%3D; ComponentLink3Description: URL Link2; ComponentLink3URL: https://www.digikey.com/en/products/detail/abracon-llc/ABLS-4-000MHZ-K4T/2001297